# EAGLE schematic smartclamp v0.14 (EAGLE 9.5.0)
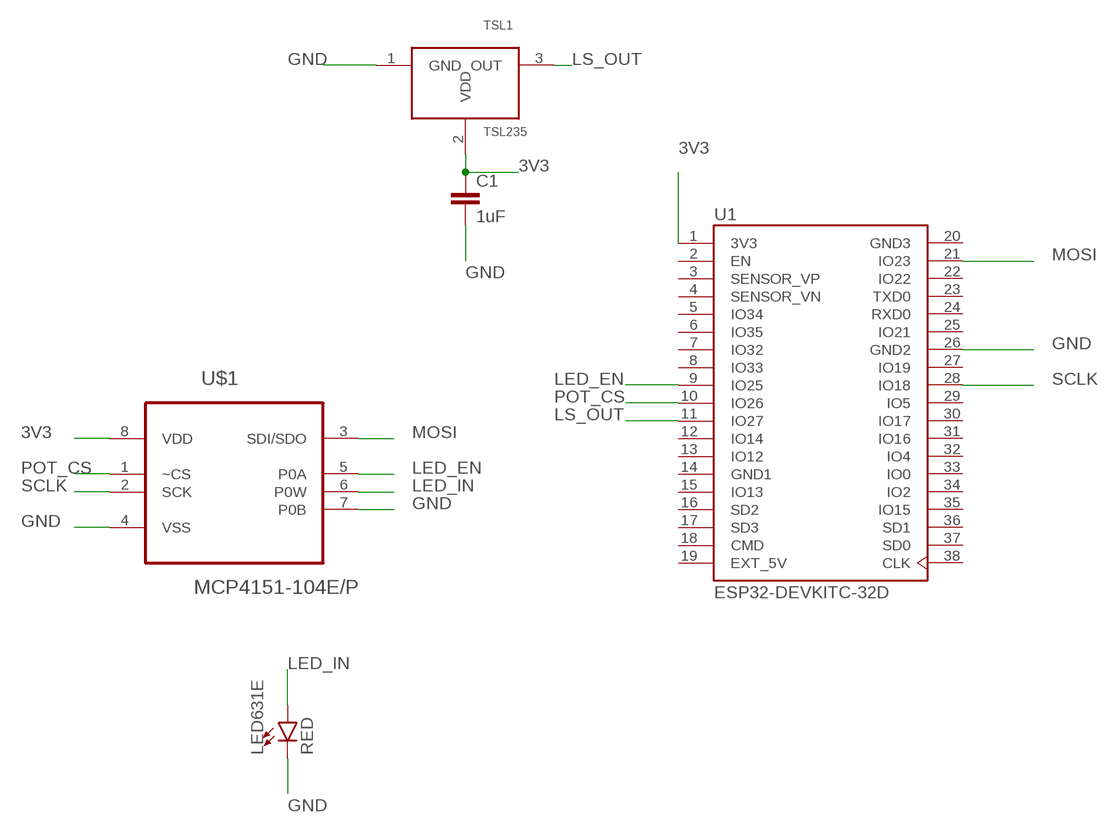
[diagram p0: schematic, sheet 1]

## Parts
C1  1uF  1.0NF/1000PF-0603-50V-10%  [0603]
LED631E  RED  LED-RED1206  [LED-1206]
TSL1  TSL235  [TSL235-P]
U1  ESP32-DEVKITC-32D  [MODULE_ESP32-DEVKITC-32D]
U$1  MCP4151-104E/P  [DIP254P762X533-8]

## Nets
3V3: C1.1 TSL1.2(VDD) U1.1(3V3) U$1.8(VDD)
GND: C1.2 LED631E.C TSL1.1(GND) U1.26(GND2) U$1.4(VSS) U$1.7(P0B)
LED_EN: U1.9(IO25) U$1.5(P0A)
LED_IN: LED631E.A U$1.6(P0W)
LS_OUT: TSL1.3(OUT) U1.11(IO27)
MOSI: U1.21(IO23) U$1.3(SDI/SDO)
POT_CS: U1.10(IO26) U$1.1(~CS)
SCLK: U1.28(IO18) U$1.2(SCK)
Unconnected: U1.2(EN) U1.3(SENSOR_VP) U1.4(SENSOR_VN) U1.5(IO34) U1.6(IO35) U1.7(IO32) U1.8(IO33) U1.12(IO14) U1.13(IO12) U1.15(IO13) U1.16(SD2) U1.17(SD3) U1.18(CMD) U1.22(IO22) U1.23(TXD0) U1.24(RXD0) U1.25(IO21) U1.27(IO19) U1.29(IO5) U1.30(IO17) U1.31(IO16) U1.32(IO4) U1.33(IO0) U1.34(IO2) U1.35(IO15) U1.36(SD1) U1.37(SD0) U1.38(CLK)

## Power pins joined to a net without a drawn wire
EXT_5V: U1.19(EXT_5V)
GND1: U1.14(GND1)
GND3: U1.20(GND3)

## Library data of the parts
C1 = SparkFun-Capacitors:1.0NF/1000PF: 1nF/1,000pF ceramic capacitors A capacitor is a passive two-terminal electrical component used to store electrical energy temporarily in an electric field.; PROD_ID: CAP-07886; VALUE: 1nF
LED631E = SparkFun-LED:LED-RED: Red SMD LED Used in manufacturing of most products at SparkFun Packages: 0603 - SMD 0603 package [Product Link] <http://docs.avagotech.com/docs/AV02-0551EN> 0603 SMART - SMD 0603 SMART package ( more efficient and expensive)[Product Link] <http://www.osram-os.com/Graphics/XPic2/00077099_0.pdf> 1206 - SMD1206 package [Product Link] <https://www.sparkfun.com/datasheets/DevTools/LilyPad/Q150OVS4.pdff> SparkFun Products: Pro Mini 328 -5V <https://www.sparkfun.com/products/821> RedBoard <https://www.sparkfun.com/products/12757> IOIO-OTG <https://www.sparkfun.com/products/13613>; PROD_ID: DIO-09912
TSL1 = TSL235:TSL235: TSL235 LICHT-FREQUENZ-UMSETZER LFU Farnell Best.Nr.: 1182352 Mouser Best.Nr.:856-TSL235R-LF; AVAILABILITY: Unavailable; DESCRIPTION: AMS; MF: ams; MP: TSL235; PACKAGE: None; PRICE: None
U1 = ESP32-DEVKITC-32D:ESP32-DEVKITC-32D: Eval Board For Esp-Wroom-32; AVAILABILITY: Unavailable; DESCRIPTION: EVAL BOARD FOR ESP-WROOM-32; MF: Espressif Systems; MP: ESP32-DEVKITC-32D; PACKAGE: None; PRICE: None
U$1 = MCP4151-104E_P:MCP4151-104E/P: Digital POT; AVAILABILITY: Unavailable; DESCRIPTION: Digital Potentiometer 256POS 100kOhm Single Automotive 8-Pin PDIP Tube; MF: Microchip; MP: MCP4151-104E/P; PACKAGE: PDIP-8 Microchip; PRICE: None